# EAGLE design esp8266-bme280-deepsleep (EAGLE 9.0.0)
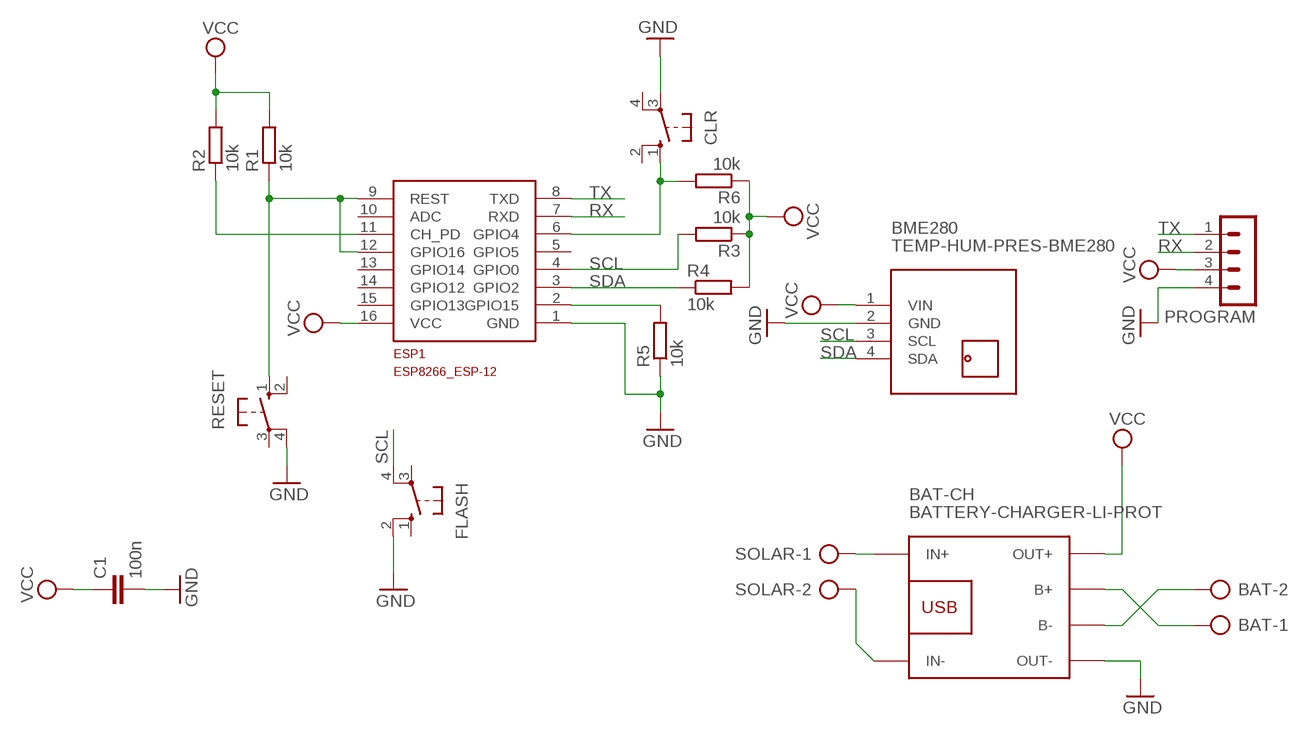
[diagram p0: schematic, sheet 1]

## Parts
BAT  PWR_CONN_KK  [PWR_CONN_KK_5MM]
BAT-CH  BATTERY-CHARGER-LI-PROT  [BATTERY-CHARGER-LI-PROT]
BME280  TEMP-HUM-PRES-BME280  [TEMP-HUM-PRES-BME280]
C1  100n  C2,5-3  [C2.5-3]
CLR  10-XX  [B3F-10XX]
ESP1  ESP8266_ESP-12  [ESP8266-ESP12]
FLASH  10-XX  [B3F-10XX]
PROGRAM  MA04-1  [MA04-1]
R1  10k  R-EU_0204/7  [0204/7]
R2  10k  R-EU_0204/7  [0204/7]
R3  10k  R-EU_0204/7  [0204/7]
R4  10k  R-EU_0204/7  [0204/7]
R5  10k  R-EU_0204/7  [0204/7]
R6  10k  R-EU_0204/7  [0204/7]
RESET  10-XX  [B3F-10XX]
SOLAR  PWR_CONN_KK  [PWR_CONN_KK_5MM]

## Nets
GND: BAT-CH.OUT- BME280.2(GND) C1.2 CLR.3(P) ESP1.1(GND) FLASH.2(S1) PROGRAM.4 R5.1 RESET.4(P1)
N$1: ESP1.9(REST) ESP1.12(GPIO16) R1.1 RESET.1(S)
N$2: ESP1.11(CH_PD) R2.1
N$3: BAT-CH.B+ BAT.1
N$4: BAT-CH.B- BAT.2
N$6: BAT-CH.IN+ SOLAR.1
N$7: BAT-CH.IN- SOLAR.2
N$8: ESP1.2(GPIO15) R5.2
N$10: CLR.1(S) ESP1.6(GPIO4) R6.2
RX: ESP1.7(RXD) PROGRAM.2
SCL: BME280.3(SCL) ESP1.4(GPIO0) FLASH.4(P1) R3.2
SDA: BME280.4(SDA) ESP1.3(GPIO2) R4.1
TX: ESP1.8(TXD) PROGRAM.1
VCC: BAT-CH.OUT+ BME280.1(VIN) C1.1 ESP1.16(VCC) PROGRAM.3 R1.2 R2.2 R3.1 R4.2 R6.1
Unconnected: CLR.2(S1) CLR.4(P1) ESP1.5(GPIO5) ESP1.10(ADC) ESP1.13(GPIO14) ESP1.14(GPIO12) ESP1.15(GPIO13) FLASH.1(S) FLASH.3(P) RESET.2(S1) RESET.3(P)

## Library data of the parts
BAT SOLAR = conn_pwr_kk:PWR_CONN_KK: CONNECTOR Aug. 2004 / PTR Meßtechnik: Die Bezeichnung der Serie AK505 wurde geändert. Es handelt sich hierbei um AK500 in horizontaler Ausführung.; OC_FARNELL: unknown; OC_NEWARK: unknown
BAT-CH = diy-modules:BATTERY-CHARGER-LI-PROT: Lithium Battery 5V Charger with protection circuit More details available here: http://www.instructables.com/id/DIY-Lithium-ion-Battery-Charger/step4/TP4056-based-lithium-ion-battery-charger-module/ Click here to find device on ebay.com <http://www.ebay.com/sch/tp4056+charger+usb+protection>
BME280 = diy-modules:TEMP-HUM-PRES-BME280: Digital Humidity-Temperature-Pressure Sensor based on BME280 device More information about BME280 device is available here: https://www.bosch-sensortec.com/bst/products/all_products/bme280 Click here to find device on ebay.com <http://www.ebay.com/sch/bme280+breakout>
C1 = capacitor-wima:C: CAPACITOR naming: grid - package width
CLR FLASH RESET = switch-omron:10-XX: OMRON SWITCH; MPN: B3F-1000; OC_FARNELL: 176432; OC_NEWARK: 36M3542
ESP1 = ESP8266-ESP12:ESP8266_ESP-12
PROGRAM = con-lstb:MA04-1: PIN HEADER; OC_FARNELL: unknown; OC_NEWARK: unknown
R1-R6 = resistor:R-EU_: RESISTOR, European symbol

## Board
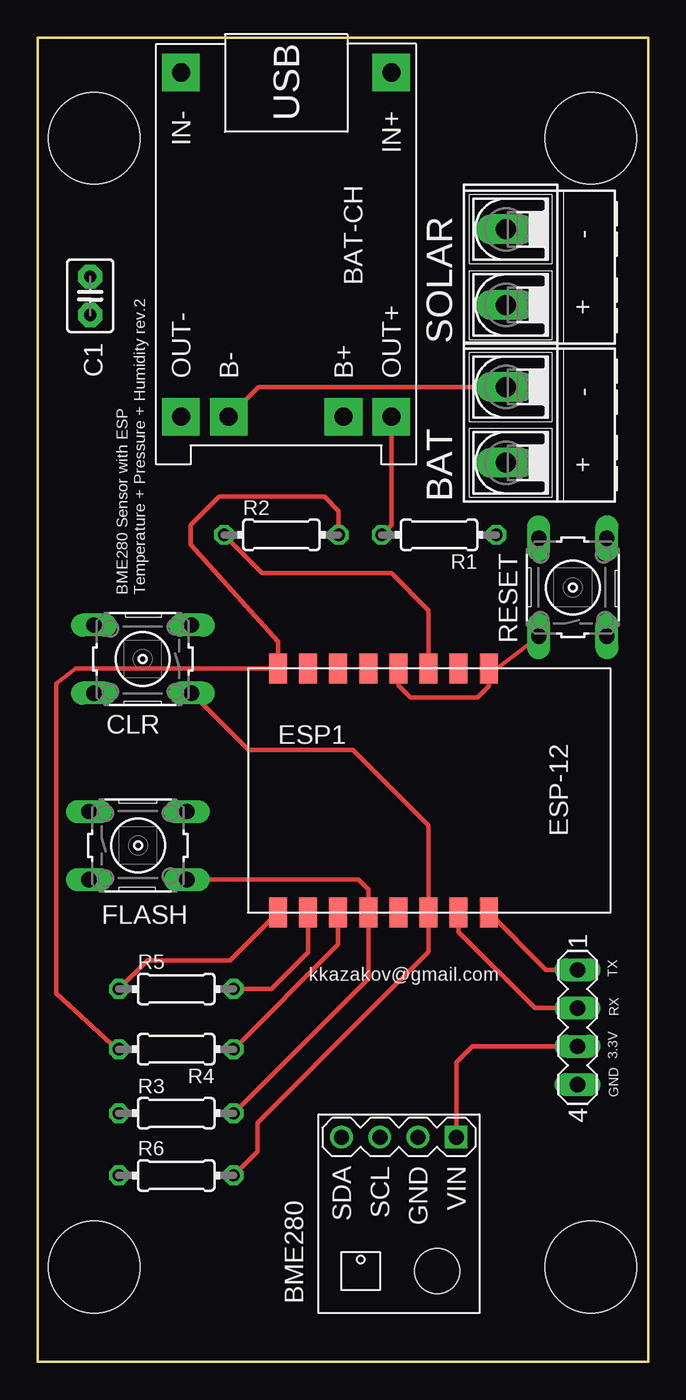
[diagram p1: board, top side]
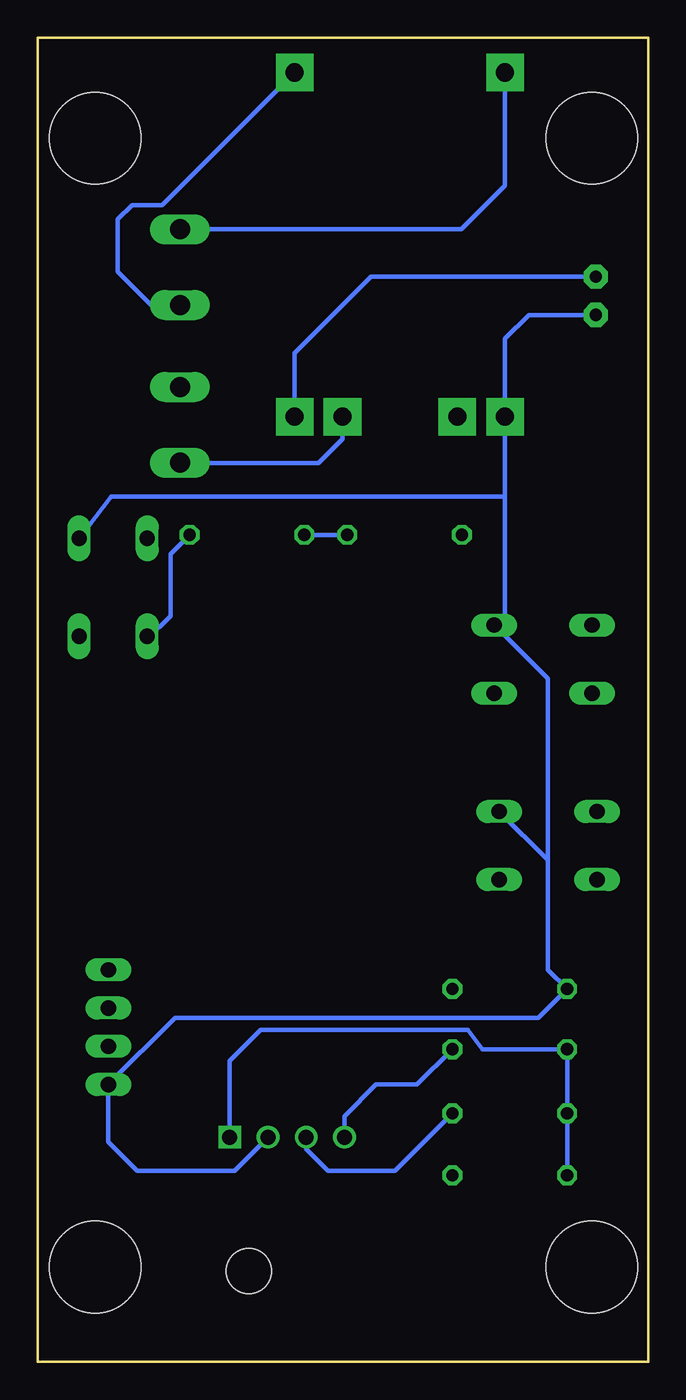
[diagram p2: board, bottom side, seen from below]

Size 40.58 x 87.95 mm. Coordinates in mm from the lower left corner, seen from the top.
Outline: 0,87.95 40.58,87.95 40.58,0 0,0 0,87.95
Copper layers (1*16): Top 0.035mm / dielectric 1.5mm / Bottom 0.035mm
Design rules "default": minimum track width 6mil, minimum drill 0.35mm, track to track 6mil, track to pad 6mil, pad to pad 6mil, via to via 6mil, smd to smd 6mil, copper to edge 40mil, drill to drill 6mil, minimum pad ring 10mil, minimum via ring 8mil, stop-mask expansion 4mil, vias tented up to drill 0mil, thermal gap 10mil
Holes 6.1 mm at 3.76,81.27 36.75,81.27 3.76,6.29 36.75,6.29

### Footprints (pad centres in the part's own frame; a part is rotated, then mirrored left to right if it is on the bottom)
PWR_CONN_KK_5MM = drill 1.321 long: 1 -2.515,0; 2 2.515,0
BATTERY-CHARGER-LI-PROT = drill 1.2 pad 2.5 square: B+ 10.795,3.81; B- 10.795,-3.81; IN+ -12.065,6.985; IN- -12.065,-6.985; OUT+ 10.795,6.985; OUT- 10.795,-6.985
TEMP-HUM-PRES-BME280 = drill 1 square: 1 -5.08,3.81 | drill 1: 2 -5.08,1.27; 3 -5.08,-1.27; 4 -5.08,-3.81 | hole 3: 3.81,2.54
C2.5-3 = drill 0.813 pad 1.6 octagon: 1 -1.27,0; 2 1.27,0
B3F-10XX = drill 1.016 long: 1 -3.251,2.261; 2 3.251,2.261; 3 -3.251,-2.261; 4 3.251,-2.261
ESP8266-ESP12 = smd 2 x 1.2: 1 16.2,2; 2 16.2,4; 3 16.2,6; 4 16.2,8; 5 16.2,10; 6 16.2,12; 7 16.2,14; 8 16.2,16; 9 0,16; 10 0,14; 11 0,12; 12 0,10; 13 0,8; 14 0,6; 15 0,4; 16 0,2
MA04-1 = drill 1.016 long: 1 -3.81,0; 2 -1.27,0; 3 1.27,0; 4 3.81,0
0204/7 = drill 0.813 octagon: 1 -3.81,0; 2 3.81,0

### Placement (x,y rotation side)
BAT  31.12,62.23 90 top
BAT-CH  16.51,73.57 270 top
BME280  24,9.84 270 top
C1  3.49,70.8 270 top
CLR  6.98,46.67 180 top
ESP1  13.97,46.04 270 top
FLASH  6.67,34.29 0 top
PROGRAM  35.88,22.23 270 top
R1  26.67,54.93 180 top
R2  16.19,54.93 0 top
R3  9.21,16.51 0 top
R4  9.21,20.76 180 top
R5  9.21,24.77 0 top
R6  9.21,12.38 0 top
RESET  35.56,51.44 90 top
SOLAR  31.12,72.71 90 top

### Tracks (layer width: path | path; a pad name or v marks a point on that pad's centre or on a via)
GND
  Top 0.305: ESP1.1 12.8,26.67 7.3,26.67 R5.1
  Bottom 0.305: PROGRAM.4 31.43,22.86 7.3,22.86 R5.1 6.67,26.03 6.67,33.3 6.69,33.32 | 35.88,18.1 PROGRAM.4 | 9.52,57.47 BAT-CH.OUT- 9.52,67.94 7.94,69.53 C1.2 | 9.52,57.47 9.52,49.64 CLR.3 6.69,45.38 6.69,33.32 | FLASH.2 6.69,33.32 | RESET.4 35.67,57.47 9.52,57.47 | BME280.2 27.49,12.7 33.97,12.7 35.88,14.6 PROGRAM.4
N$1
  Top 0.305: RESET.1 30.52,46.04 ESP1.9 29.97,44.89 29.21,44.13 24.77,44.13 23.97,44.93 ESP1.12
  Bottom 0.305: R1.1 31.75,53.66 31.75,49.53 32.46,48.82 RESET.1
N$2
  Top 0.305: R2.1 14.92,52.39 23.49,52.39 25.97,49.91 ESP1.11
N$3
  Bottom 0.305: BAT-CH.B+ 20.32,61.28 21.91,59.69 31.09,59.69 BAT.1
N$4
  Top 0.305: BAT-CH.B- 14.67,64.74 BAT.2
N$6
  Bottom 0.305: BAT-CH.IN+ 32.29,76.84 34.29,76.84 35.24,75.88 35.24,72.39 33.05,70.19 SOLAR.1
N$7
  Bottom 0.305: BAT-CH.IN- 9.52,78.1 12.41,75.22 SOLAR.2
N$8
  Top 0.305: ESP1.2 17.97,27.18 15.56,24.76 R5.2
N$10
  Top 0.305: R6.2 14.61,13.97 14.61,15.87 22.23,23.5 25.97,27.24 ESP1.6 25.97,35.62 20.95,40.64 14.01,40.64 CLR.1
RX
  Top 0.305: ESP1.7 27.97,28.55 33.02,23.5 PROGRAM.2
SCL
  Top 0.305: R3.2 21.97,25.46 ESP1.4 21.97,31.37 21.31,32.03 FLASH.4
  Bottom 0.305: R3.2 16.83,12.7 21.27,12.7 22.73,14.16 BME280.3
SDA
  Top 0.305: R4.1 19.97,27.72 ESP1.3
  Bottom 0.305: R4.1 15.37,18.42 18.1,18.42 20.19,16.32 BME280.4
TX
  Top 0.305: ESP1.8 33.77,26.03 PROGRAM.1
VCC
  Top 0.305: BAT-CH.OUT+ 23.49,55.56 R1.2 | R4.2 5.27,20.76 1.25,24.47 1.25,45.06 2.54,46.04 ESP1.16 15.97,47.85 10.16,54.29 10.16,55.56 12.07,57.47 19.05,57.47 20,56.51 R2.2 | PROGRAM.3 28.89,20.95 27.81,19.88 BME280.1
  Bottom 0.305: R6.1 R3.1 R4.2 11.02,20.76 11.98,22.05 25.77,22.05 27.81,20 BME280.1 | R2.2 R1.2 | C1.1 18.41,72.07 23.49,66.99 BAT-CH.OUT+

### Text on the board
tNames: BME280 Sensor with ESP / Temperature + Pressure + Humidity rev.2 | kkazakov@gmail.com | TX | RX | 3.3V | GND